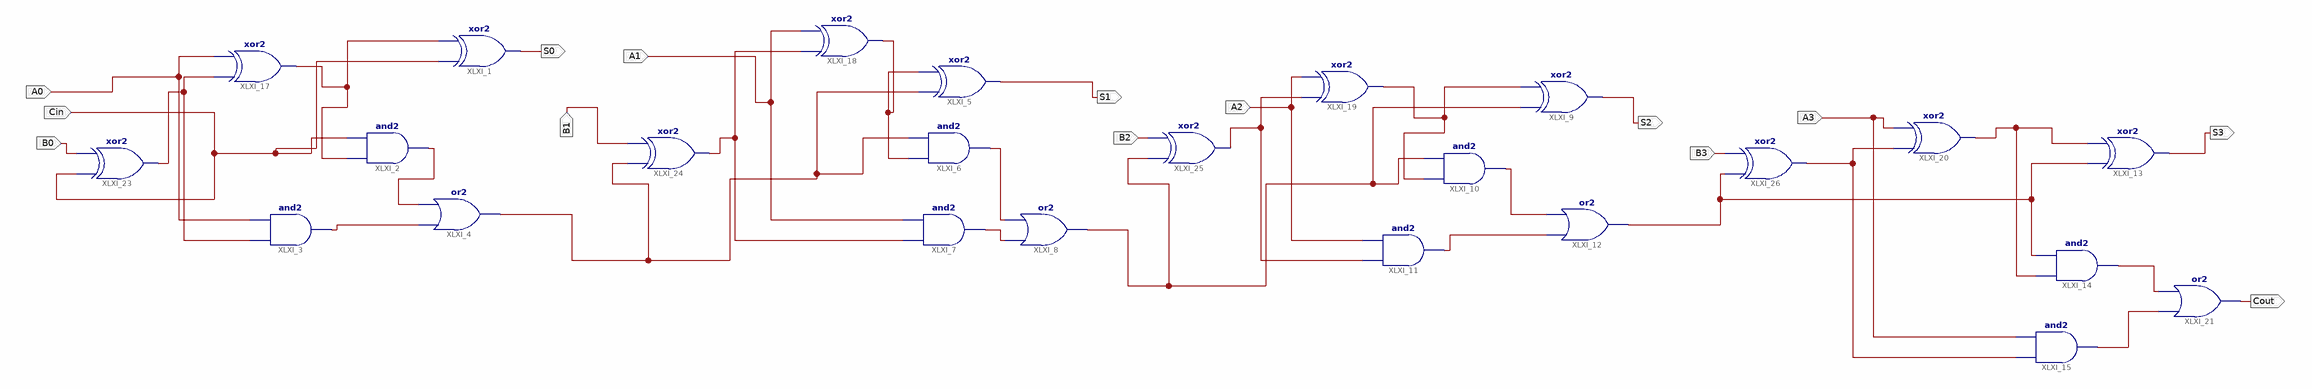
[diagram p0: schematic sheet 1]
// Xilinx ISE schematic labo7part3.sch (xa9500xl) as structural Verilog: 24 symbols, 14 ports
module labo7part3 (
  input  Cin,
  input  A0,
  input  A1,
  input  A2,
  input  B0,
  input  B1,
  input  B2,
  input  A3,
  input  B3,
  output S0,
  output S1,
  output S2,
  output S3,
  output Cout
);

  wire XLXN_2, XLXN_3, XLXN_4, XLXN_6, XLXN_7, XLXN_9, XLXN_17, XLXN_18, XLXN_19, XLXN_23, XLXN_25, XLXN_26,
       XLXN_50, XLXN_51, XLXN_60, XLXN_61, XLXN_62, XLXN_220;

  xor XLXI_1 (S0, Cin, XLXN_2);
  and XLXI_2 (XLXN_3, XLXN_2, Cin);
  and XLXI_3 (XLXN_4, B0, A0);
  or XLXI_4 (XLXN_51, XLXN_4, XLXN_3);
  xor XLXI_5 (S1, XLXN_51, XLXN_9);
  and XLXI_6 (XLXN_6, XLXN_9, XLXN_51);
  and XLXI_7 (XLXN_7, XLXN_50, A1);
  or XLXI_8 (XLXN_60, XLXN_7, XLXN_6);
  xor XLXI_9 (S2, XLXN_60, XLXN_17);
  and XLXI_10 (XLXN_18, XLXN_17, XLXN_60);
  and XLXI_11 (XLXN_19, XLXN_61, A2);
  or XLXI_12 (XLXN_220, XLXN_19, XLXN_18);
  xor XLXI_17 (XLXN_2, B0, A0);
  xor XLXI_18 (XLXN_9, XLXN_50, A1);
  xor XLXI_19 (XLXN_17, XLXN_61, A2);
  xor XLXI_23 (B0, Cin, B0);
  xor XLXI_24 (XLXN_50, XLXN_51, B1);
  xor XLXI_25 (XLXN_61, XLXN_60, B2);
  and XLXI_15 (XLXN_25, XLXN_62, A3);
  or XLXI_21 (Cout, XLXN_25, XLXN_26);
  xor XLXI_26 (XLXN_62, XLXN_220, B3);
  xor XLXI_20 (XLXN_23, XLXN_62, A3);
  xor XLXI_13 (S3, XLXN_220, XLXN_23);
  and XLXI_14 (XLXN_26, XLXN_23, XLXN_220);
endmodule
